# EAGLE design Enlighten-PL9823 (EAGLE 7.5.0)
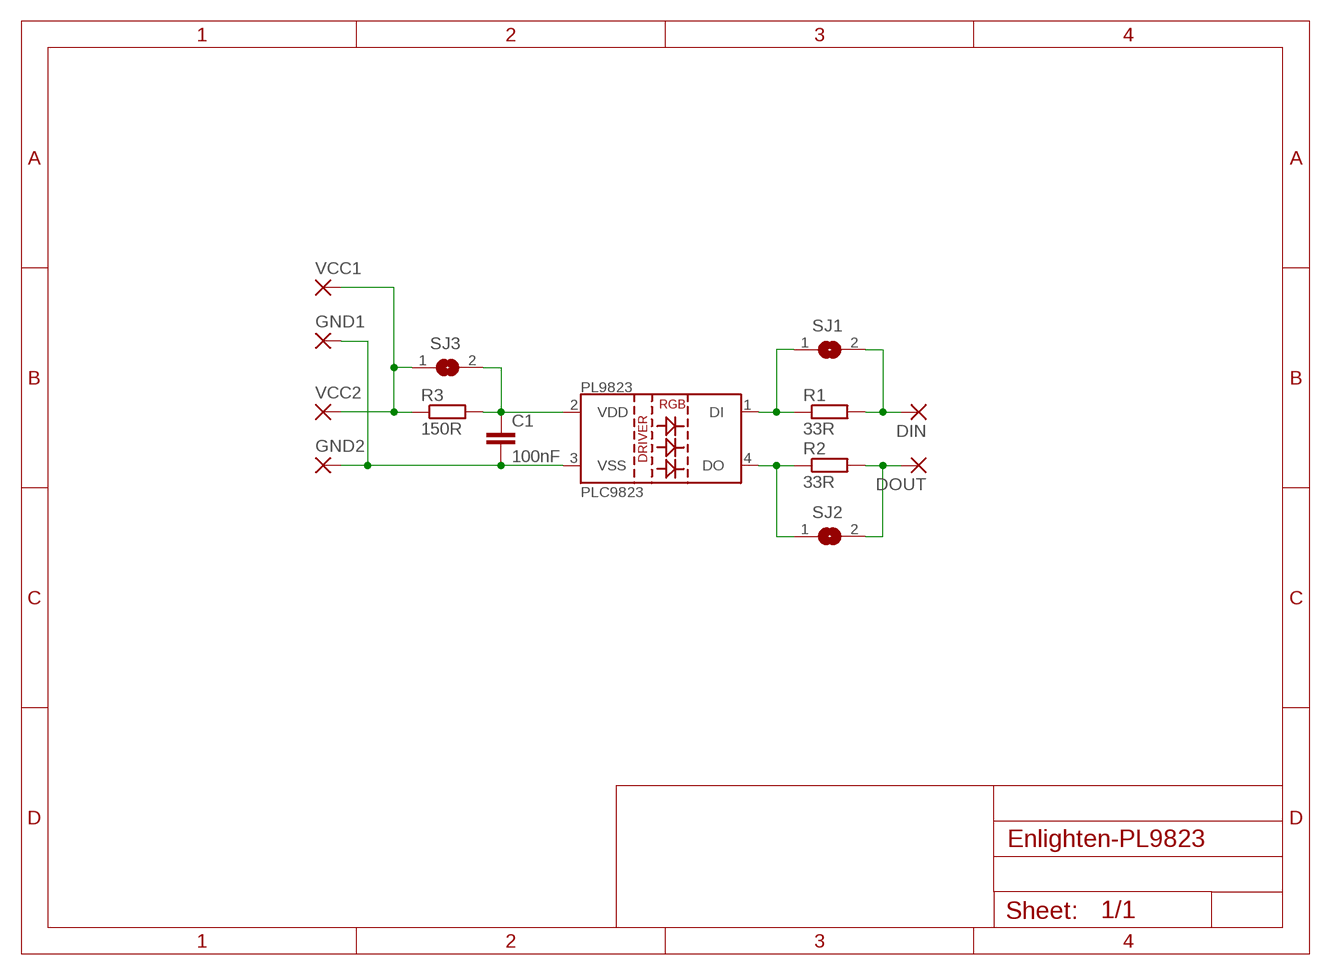
[diagram p0: schematic, sheet 1]

## Parts
C1  100nF  C-EU025-024X044  [C025-024X044]
DIN  SMD2  [SMD1,27-2,54]
DOUT  SMD2  [SMD1,27-2,54]
GND1  SMD5  [SMD2,54-5,08]
GND2  SMD5  [SMD2,54-5,08]
PLC9823  LED-PL9823-F5W  [LED-PL9823-F5W]
R1  33R  R-EU_0207/10  [0207/10]
R2  33R  R-EU_0207/10  [0207/10]
R3  150R  R-EU_0207/10  [0207/10]
SJ1  SJ  [SJ]
SJ2  SJ  [SJ]
SJ3  SJ  [SJ]
VCC1  SMD5  [SMD2,54-5,08]
VCC2  SMD5  [SMD2,54-5,08]

## Nets
GND: C1.2 GND1.1(P) GND2.1(P) PLC9823.3(VSS)
N$1: PLC9823.1(DI) R1.1 SJ1.1
N$2: PLC9823.4(DO) R2.1 SJ2.1
N$3: DIN.1(P) R1.2 SJ1.2
N$4: DOUT.1(P) R2.2 SJ2.2
N$5: C1.1 PLC9823.2(VDD) R3.2 SJ3.2
VCC: R3.1 SJ3.1 VCC1.1(P) VCC2.1(P)

## Library data of the parts
C1 = rcl:C-EU: CAPACITOR, European symbol
DIN DOUT = Enlighten:SMD2: SMD PAD
GND1 GND2 VCC1 VCC2 = Enlighten:SMD5: SMD PAD
PLC9823 = Enlighten:LED-PL9823-F5W
R1-R3 = rcl:R-EU_: RESISTOR, European symbol
SJ1-SJ3 = Enlighten:SJ: SMD solder JUMPER

## Board
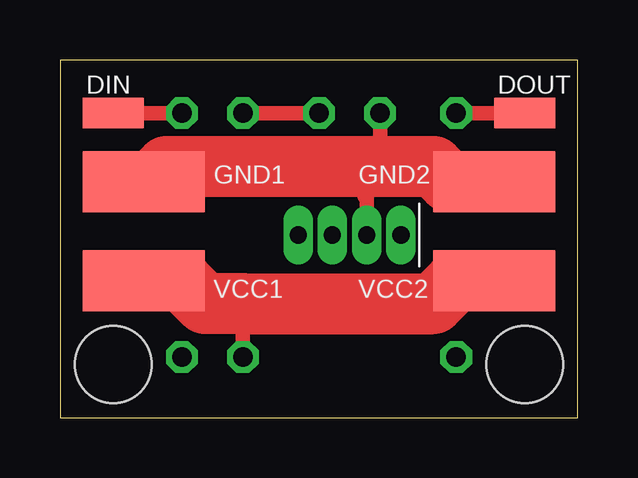
[diagram p1: board, top side]
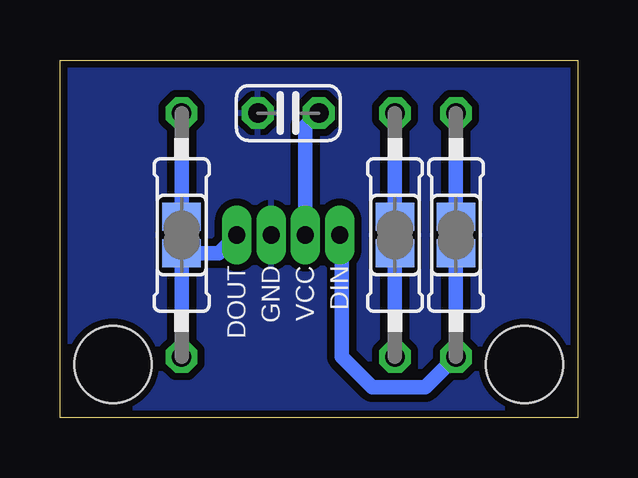
[diagram p2: board, bottom side, seen from below]

Size 21.58 x 14.91 mm. Coordinates in mm from the lower left corner, seen from the top.
Outline: 0,0 21.58,0 21.58,14.91 0,14.91 0,0
Copper layers (1*16): Top 0.035mm / dielectric 1.5mm / Bottom 0.035mm
Design rules "dirt_cheap_dirty_boards.v1": minimum track width 5mil, minimum drill 12mil, track to track 5mil, track to pad 5mil, pad to pad 5mil, via to via 5mil, smd to smd 0mil, copper to edge 10mil, drill to drill 10mil, minimum pad ring 10mil, minimum via ring 6mil, stop-mask expansion 2mil, vias tented up to drill 25mil, thermal gap 10mil
Holes 3.2 mm at 2.22,2.22 19.37,2.22

### Footprints (pad centres in the part's own frame; a part is rotated, then mirrored left to right if it is on the bottom)
C025-024X044 = drill 0.813 octagon: 1 -1.27,0; 2 1.27,0
SMD1,27-2,54 = smd 1.27 x 2.54: 1 0,0
SMD2,54-5,08 = smd 2.54 x 5.08: 1 0,0
LED-PL9823-F5W = drill 0.711 pad 0.889 long: 1 -2.143,0; 2 -0.714,0; 3 0.714,0; 4 2.143,0
0207/10 = drill 0.813 octagon: 1 -5.08,0; 2 5.08,0
SJ = smd 1.168 x 1.6: 1 -0.762,0; 2 0.762,0

### Placement (x,y rotation side)
C1  12.06,12.7 180 bottom
DIN  2.22,12.7 90 top
DOUT  19.37,12.7 90 top
GND1  3.49,9.84 90 top
GND2  18.1,9.84 90 top
PLC9823  12.06,7.62 0 top
R1  5.08,7.62 90 bottom
R2  16.51,7.62 90 bottom
R3  7.62,7.62 90 bottom
SJ1  5.08,7.62 90 bottom
SJ2  16.51,7.62 90 bottom
SJ3  7.62,7.62 90 bottom
VCC1  3.49,5.71 90 top
VCC2  18.1,5.71 90 top

### Tracks (layer width: path | path; a pad name or v marks a point on that pad's centre or on a via)
GND
  Top 0.61: 13.34,10.48 C1.2 | 12.7,10.48 12.7,9.21 12.78,9.13 PLC9823.3
  Top 2.54: GND1.1 3.81,9.84 4.45,10.48 12.7,10.48 13.34,10.48 15.56,10.48 16.19,9.84 GND2.1
  pour Bottom (isolate 0.305): 0,0 0,14.92 21.59,14.92 21.59,0
N$1
  Bottom 0.61: SJ1.1 R1.1 6.35,1.27 8.57,1.27 9.84,2.54 9.84,7.54 PLC9823.1
N$2
  Bottom 0.61: R2.1 SJ2.1 14.97,6.86 PLC9823.4
N$3
  Top 0.61: DIN.1 R1.2
  Bottom 0.406: SJ1.2 5.08,8.57
  Bottom 0.61: 5.08,8.57 R1.2
N$4
  Top 0.61: DOUT.1 R2.2
  Bottom 0.61: R2.2 SJ2.2
N$5
  Top 0.61: R3.2 C1.1
  Bottom 0.61: SJ3.2 R3.2 | PLC9823.2 11.35,12.14 C1.1
VCC
  Top 0.61: 7.62,4.76 R3.1
  Top 2.54: VCC2.1 16.51,5.71 15.56,4.76 7.62,4.76 6.03,4.76 5.08,5.71 VCC1.1
  Bottom 0.61: SJ3.1 R3.1

### Text on the board
bPlace: DIN | VCC | GND | DOUT